# EAGLE design FTDI_AIO (EAGLE 6.4)
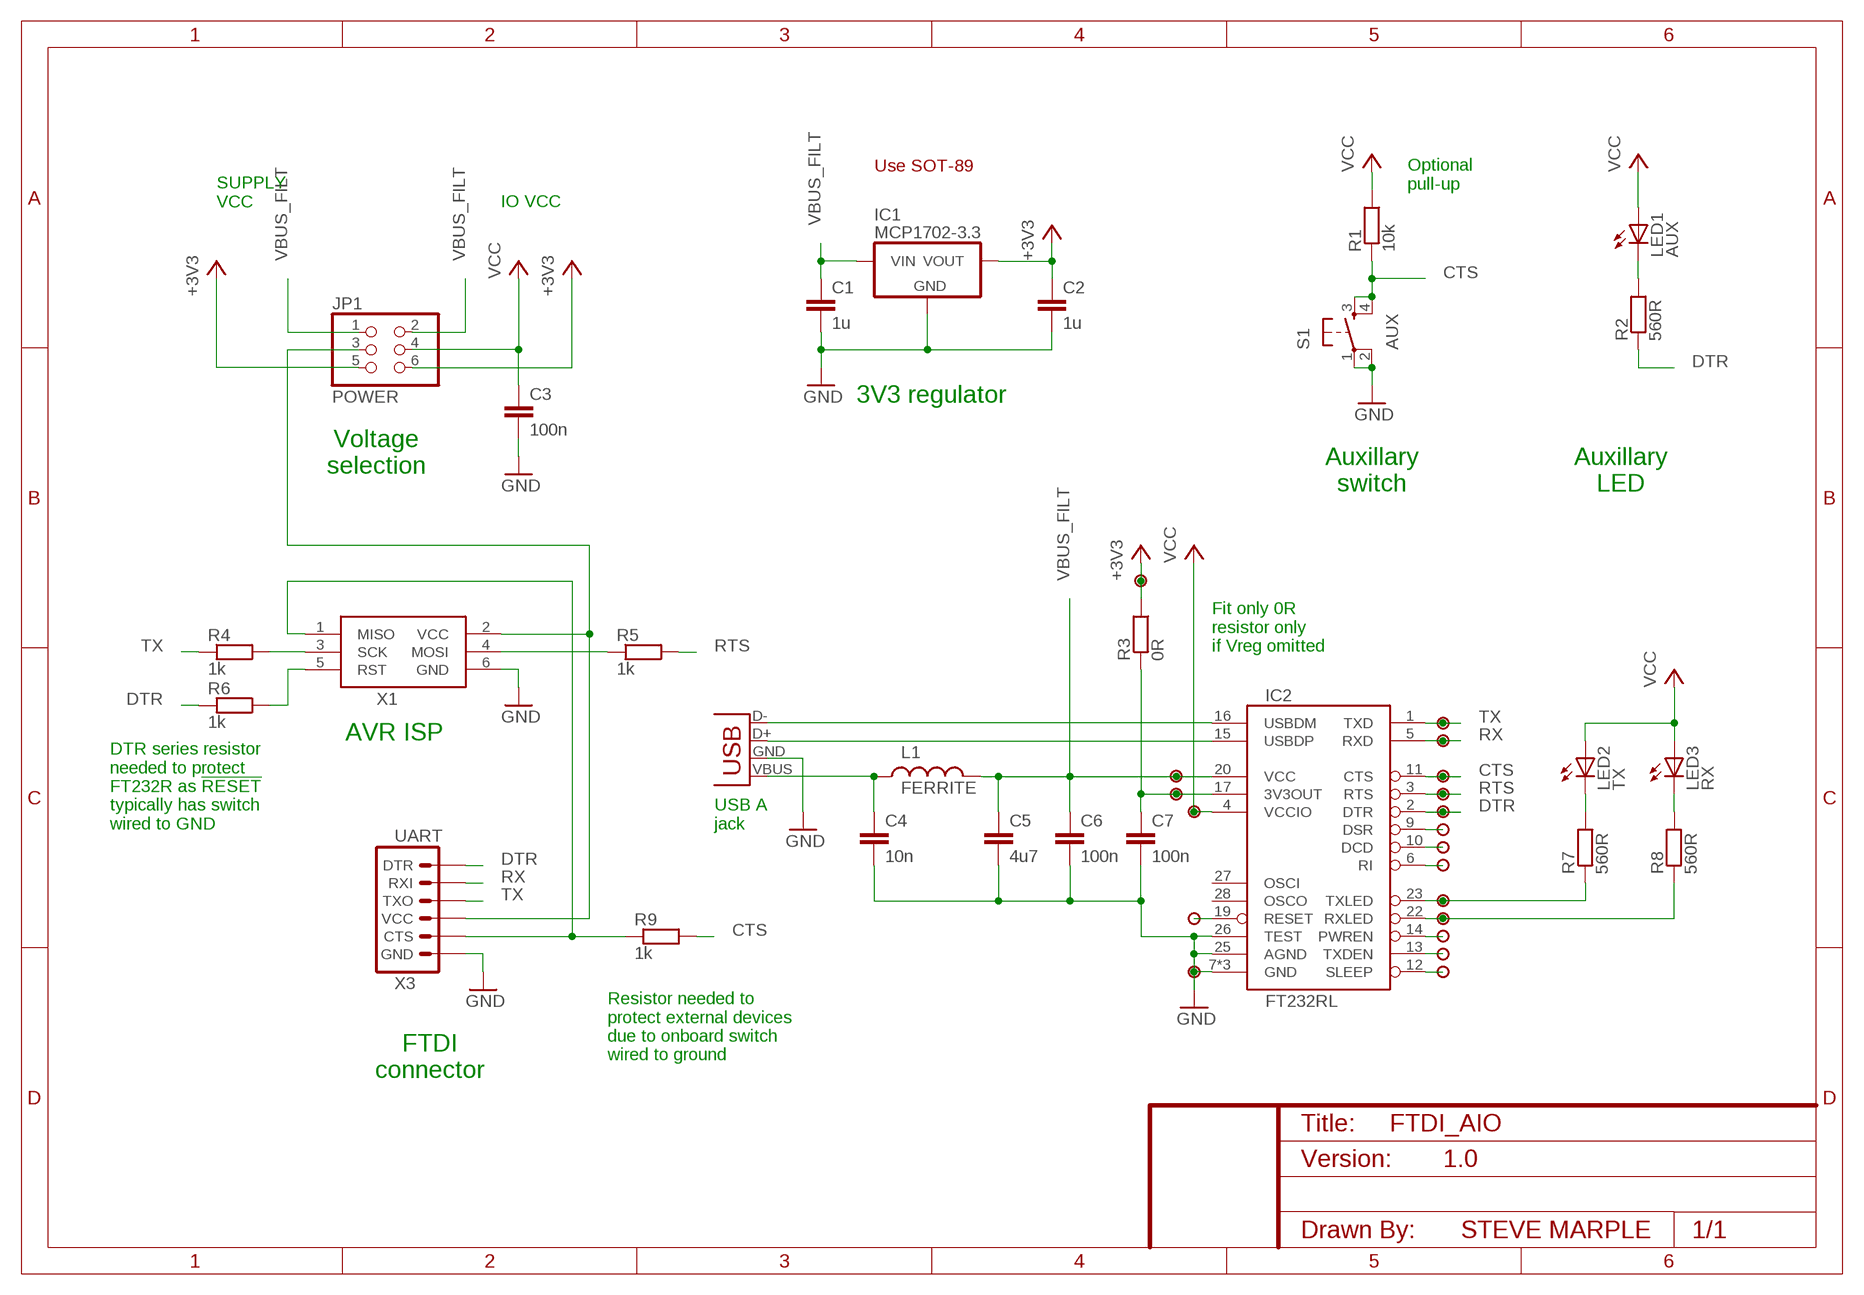
[diagram p0: schematic, sheet 1]

## Parts
C1  1u  C-EU1206-HAND  [1206-HAND]
C2  1u  C-EU1206-HAND  [1206-HAND]
C3  100n  C-EU1206-HAND  [1206-HAND]
C4  10n  C-EU1206-HAND  [1206-HAND]
C5  4u7  C-EU1206-HAND  [1206-HAND]
C6  100n  C-EU1206-HAND  [1206-HAND]
C7  100n  C-EU1206-HAND  [1206-HAND]
IC1  MCP1702-3.3  MCP1702  [TO-92]
IC2  FT232RL  FT232RLSSOP-HAND  [SSOP28-HAND]
JP1  POWER  PINHD-2X3  [2X03]
L1  FERRITE  INDUCTOR0805-HAND  [0805-HAND]
LED1  AUX  LED3MM  [LED3MM]
LED2  TX  LED3MM  [LED3MM]
LED3  RX  LED3MM  [LED3MM]
R1  10k  RESISTOR1206-HAND  [1206-HAND]
R2  560R  RESISTOR1206-HAND  [1206-HAND]
R3  0R  RESISTOR1206-HAND  [1206-HAND]
R4  1k  RESISTOR1206-HAND  [1206-HAND]
R5  1k  RESISTOR1206-HAND  [1206-HAND]
R6  1k  RESISTOR1206-HAND  [1206-HAND]
R7  560R  RESISTOR1206-HAND  [1206-HAND]
R8  560R  RESISTOR1206-HAND  [1206-HAND]
R9  1k  RESISTOR1206-HAND  [1206-HAND]
S1  AUX  TAC_SWITCHPTH  [TACTILE-PTH]
U$1  PAD  [PAD]
U$2  PAD  [PAD]
U$3  PAD  [PAD]
U$4  PAD  [PAD]
U$5  PAD  [PAD]
U$6  PAD  [PAD]
U$7  PAD  [PAD]
U$8  PAD  [PAD]
U$9  PAD  [PAD]
U$10  PAD  [PAD]
U$11  PAD  [PAD]
U$12  PAD  [PAD]
U$13  PAD  [PAD]
U$14  PAD  [PAD]
U$15  PAD  [PAD]
U$16  PAD  [PAD]
U$17  PAD  [PAD]
U$18  PAD  [PAD]
U$19  PAD  [PAD]
X1  ISP  AVRISP-HEADER-6-SHROUDED  [CONN-HARTING-ML6]
X2  USB-A-H  [USB-A-H]
X3  UART  ARDUINO_SERIAL_PROGRAMPTH  [1X06]

## Nets
3V3_OUT: C7.1 IC2.17(3V3OUT) R3.1 U$6.1
!RESET: IC2.19(RESET) U$14.1
+3V3: C2.1 IC1.3(VOUT) JP1.5 JP1.6 R3.2 U$1.1
CTS: IC2.11(CTS) R1.1 R9.2 S1.3 S1.4 U$5.1
CTS_PROT: R9.1 X1.1(MISO) X3.5(CTS)
DTR: IC2.2(DTR) R2.1 R6.1 U$9.1 X3.1(DTR)
EXT_VCC: JP1.3 X1.2(VCC) X3.4(VCC)
GND [power]: C1.2 C2.2 C3.2 C4.2 C5.2 C6.2 C7.2 IC1.1(GND) IC2.7(GND) IC2.18(GND) IC2.21(GND) IC2.25(AGND) IC2.26(TEST) S1.1 S1.2 U$18.1 X1.6(GND) X2.GND(VBUS) X3.6(GND)
N$1: LED1.K(C) R2.2
N$2: R5.1 X1.4(MOSI)
N$7: LED2.K(C) R7.2
N$9: LED3.K(C) R8.2
N$14: IC2.9(DSR) U$10.1
N$21: IC2.10(DCD) U$11.1
N$22: IC2.6(RI) U$12.1
N$23: IC2.14(PWREN) U$16.1
N$24: IC2.13(TXDEN) U$17.1
N$25: IC2.12(SLEEP) U$19.1
RST: R6.2 X1.5(RST)
RTS: IC2.3(RTS) R5.2 U$7.1
RX: IC2.5(RXD) U$3.1 X3.2(RXI)
RXLED: IC2.22(RXLED) R8.1 U$15.1
SCK: R4.2 X1.3(SCK)
TX: IC2.1(TXD) R4.1 U$2.1 X3.3(TXO)
TXLED: IC2.23(TXLED) R7.1 U$13.1
USB_D+: IC2.15(USBDP) X2.D+(D-)
USB_D-: IC2.16(USBDM) X2.D-(D+)
VBUS_FILT [Vbus]: C1.1 C5.1 C6.1 IC1.2(VIN) IC2.20(VCC) JP1.1 JP1.2 L1.2 U$4.1
VCC [power]: C3.1 IC2.4(VCCIO) JP1.4 LED1.A LED2.A LED3.A R1.2 U$8.1
VUSB [Vbus]: C4.1 L1.1 X2.VBUS(GND)
Unconnected: IC2.27(OSCI) IC2.28(OSCO)

## Notes on the sheet
- Use SOT-89
- Optional
  pull-up
- SUPPLY
  VCC
- IO VCC
- 3V3 regulator
- Voltage
  selection
- Auxillary
  switch
- Auxillary
  LED
- Fit only 0R
  resistor only
  if Vreg omitted
- AVR ISP
- DTR series resistor
  needed to protect
  FT232R as !RESET!
  typically has switch
  wired to GND
- USB A
  jack
- Resistor needed to
  protect external devices
  due to onboard switch
  wired to ground
- FTDI
  connector
- 1.0
- STEVE MARPLE

## Library data of the parts
C1-C7 = SteveMarple:C-EU
IC1 = SteveMarple:MCP1702: Microchip MCP1702 250mA low quiescent current (2uA) LDO voltage regulator.
IC2 = SteveMarple:FT232RL: USB UART FT232RL 4th Generation USB UART (USB <-> Serial) Controller. Spark Fun Electronics SKU : COM-00650 Derived from Sparkfun library.
JP1 = pinhead:PINHD-2X3: PIN HEADER
L1 = SteveMarple:INDUCTOR: Inductors Basic Inductor/Choke - 0603 and 1206. Footprints are not proven and vary greatly between part numbers.
LED1-LED3 = SparkFun:LED: LEDs Standard schematic elements and footprints for 5mm, 3mm, 1206, and 0603 sized LEDs. 5mm - Spark Fun Electronics SKU : COM-00529 (and others)
R1-R9 = SteveMarple:RESISTOR: 1/4W PTH resistor
S1 = SparkFun:TAC_SWITCH: Momentary Switch Button commonly used for reset or general input. Spark Fun Electronics SKU : COM-00097
U$1-U$19 = SteveMarple:PAD
X1 = SteveMarple:AVRISP: AVR ISP HEADER Standard 6 pin header for AVR programming
X2 = SteveMarple:USB: USB Connectors USB-B-PTH is fully proven SKU : PRT-00139 USB-miniB is fully proven SKU : PRT-00587 USB-A-PCB is untested. USB-A-H is throughly reviewed, but untested. Spark Fun Electronics SKU : PRT-00437 USB-B-SMT is throughly reviewed, but untested. Needs silkscreen touching up. USB-A-S has not been used/tested USB-MB-H has not been used/tested
X3 = SparkFun:ARDUINO_SERIAL_PROGRAM

## Net classes
2 Vbus: width 0.305 mm

## Board
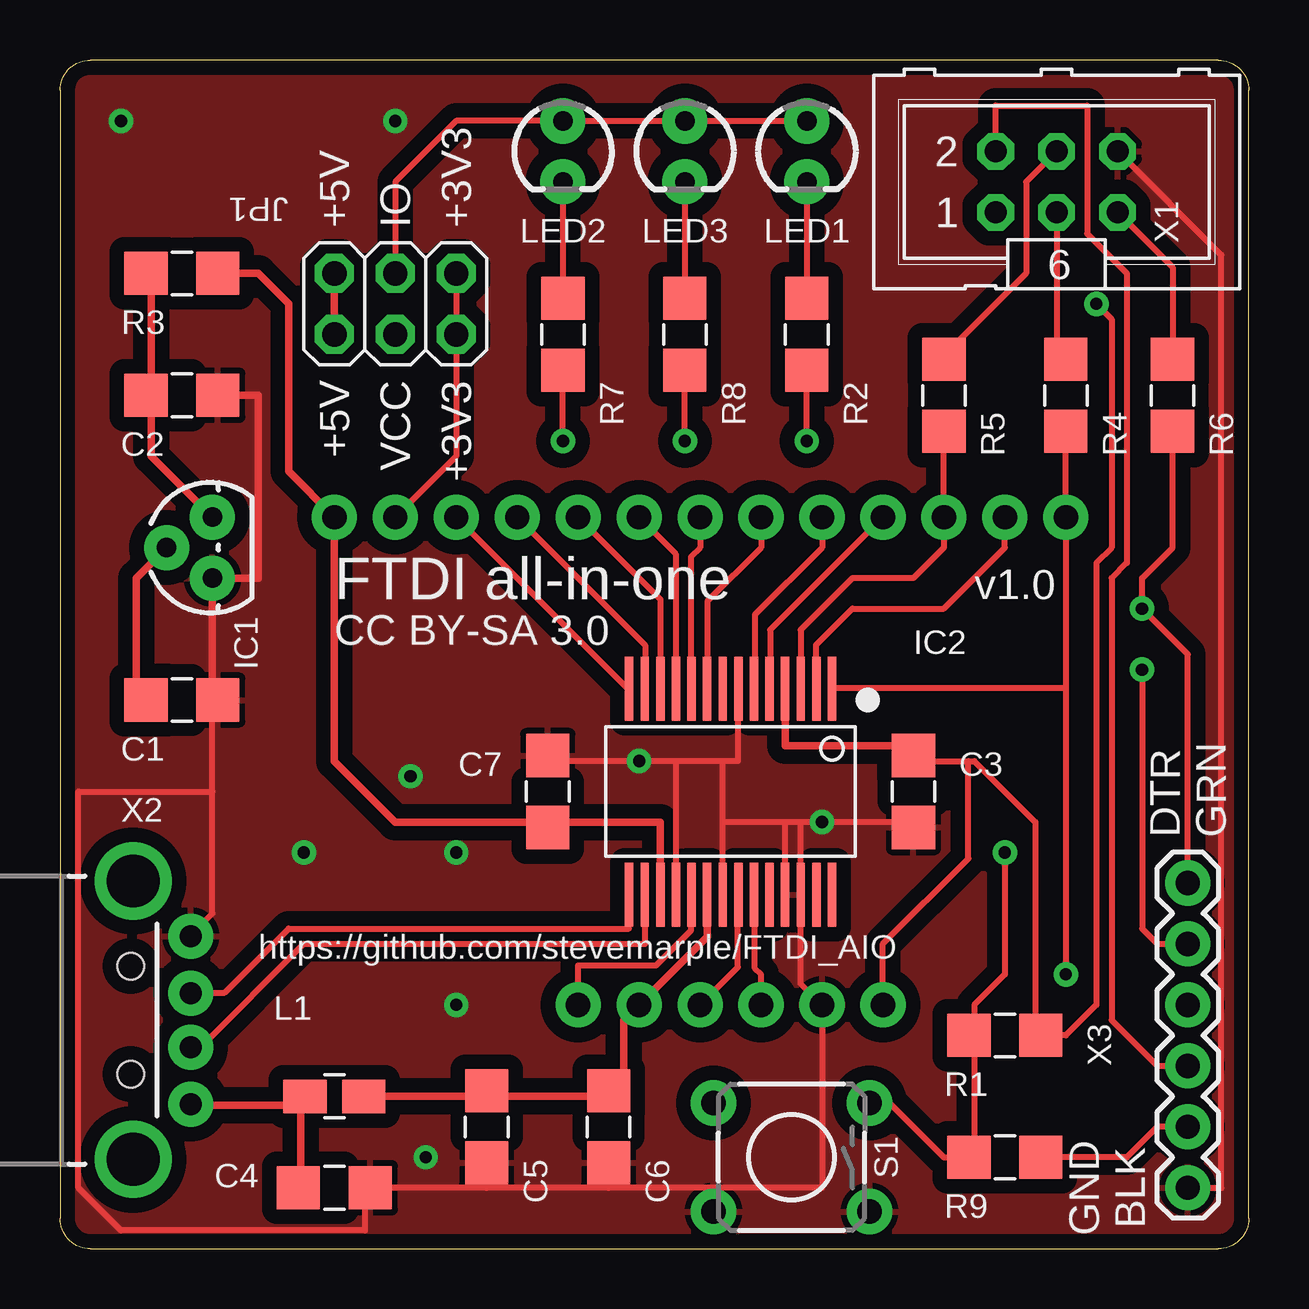
[diagram p1: board, top side]
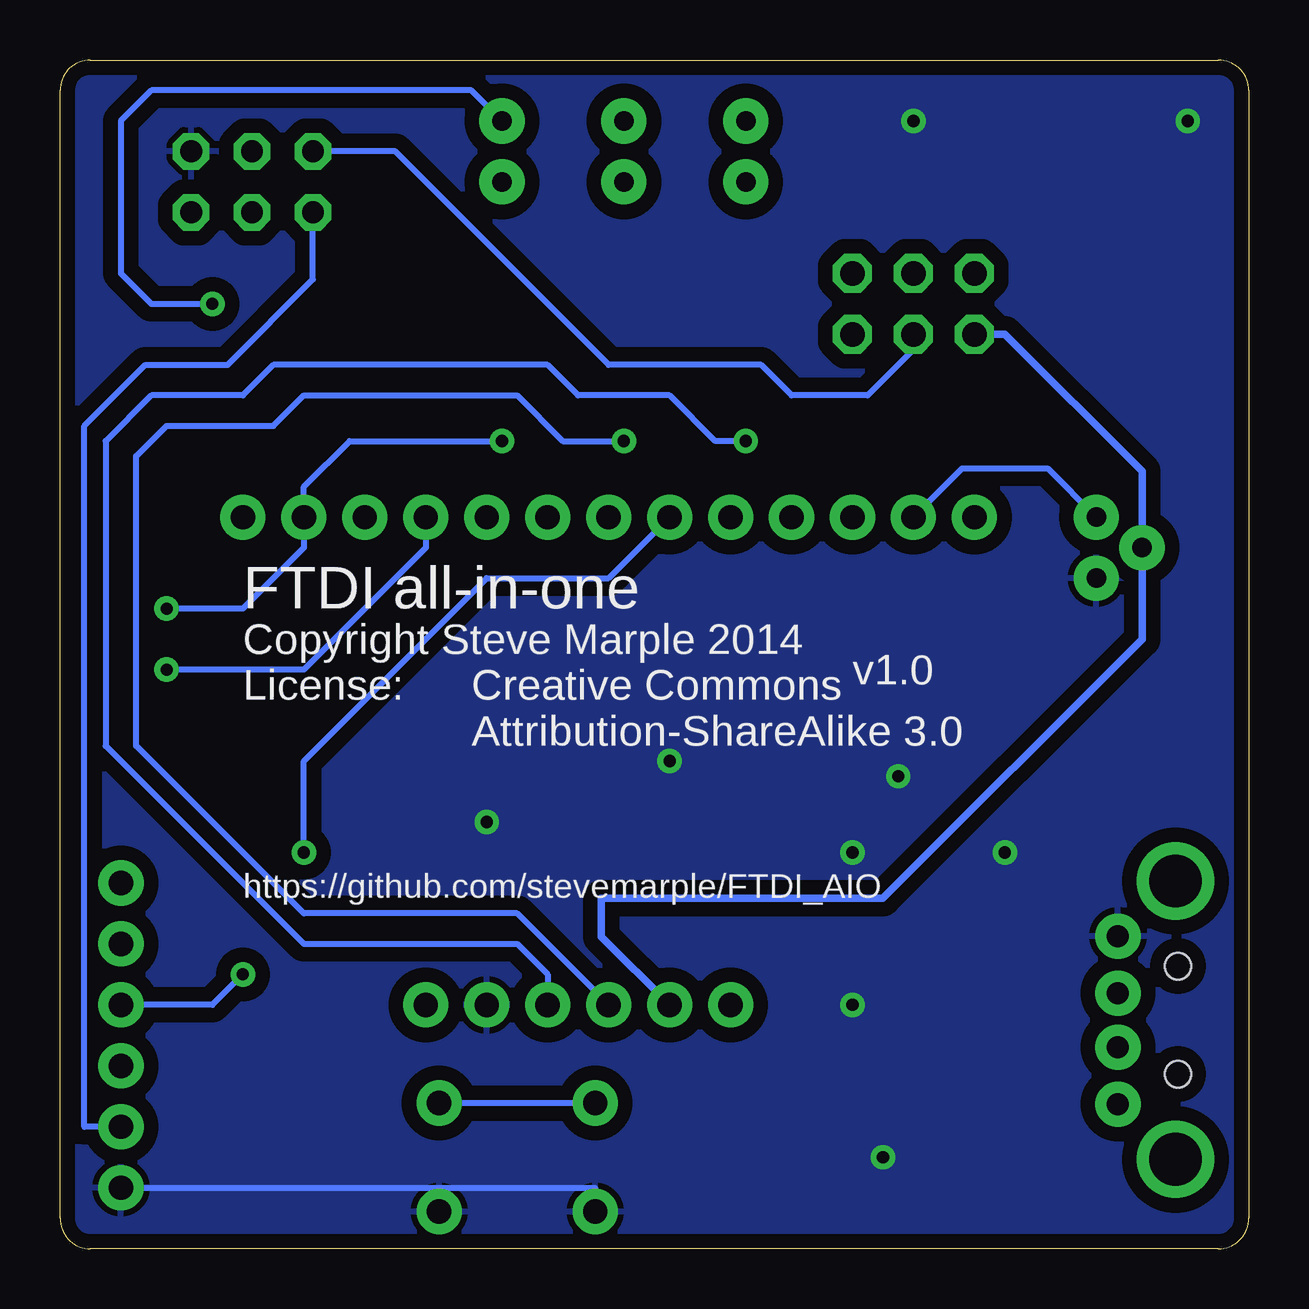
[diagram p2: board, bottom side, seen from below]

Size 49.53 x 49.53 mm. Coordinates in mm from the lower left corner, seen from the top.
Outline: 1.27,0 48.26,0 arc90 49.53,1.27 49.53,48.26 arc90 48.26,49.53 1.27,49.53 arc90 0,48.26 0,1.27 arc90 1.27,0
Copper layers (1*16): Top 0.035mm / dielectric 1.5mm / Bottom 0.035mm
Design rules "SparkFun_Iteadstudio_10mil": minimum track width 10mil, minimum drill 20mil, track to track 10mil, track to pad 10mil, pad to pad 10mil, via to via 10mil, smd to smd 10mil, copper to edge 0.5mm, drill to drill 8mil, minimum pad ring 12mil, minimum via ring 10mil, stop-mask expansion 4mil, vias tented up to drill 25mil, thermal gap 10mil

### Footprints (pad centres in the part's own frame; a part is rotated, then mirrored left to right if it is on the bottom)
1206-HAND = smd 1.8 x 1.803: 1 -1.499,0; 2 1.499,0
TO-92 = drill 0.813 pad 1.88: 1 -1.27,0; 2 0,1.905; 3 1.27,0
SSOP28-HAND = smd 0.348 x 2.667: 1 -4.225,-4.291; 2 -3.575,-4.291; 3 -2.925,-4.291; 4 -2.275,-4.291; 5 -1.625,-4.291; 6 -0.975,-4.291; 7 -0.325,-4.291; 8 0.325,-4.291; 9 0.975,-4.291; 10 1.625,-4.291; 11 2.275,-4.291; 12 2.925,-4.291; 13 3.575,-4.291; 14 4.225,-4.291; 15 4.225,4.291; 16 3.575,4.291; 17 2.925,4.291; 18 2.275,4.291; 19 1.625,4.291; 20 0.975,4.291; 21 0.325,4.291; 22 -0.325,4.291; 23 -0.975,4.291; 24 -1.625,4.291; 25 -2.275,4.291; 26 -2.925,4.291; 27 -3.575,4.291; 28 -4.225,4.291
2X03 = drill 1.016 octagon: 1 -2.54,-1.27; 2 -2.54,1.27; 3 0,-1.27; 4 0,1.27; 5 2.54,-1.27; 6 2.54,1.27
0805-HAND = smd 1.8 x 1.4: 1 -1.225,0; 2 1.225,0
LED3MM = drill 0.813 pad 1.88: A -1.27,0; K 1.27,0
TACTILE-PTH = drill 1.016 pad 1.88: 1 -3.251,2.261; 2 3.251,2.261; 3 -3.251,-2.261; 4 3.251,-2.261
PAD = drill 1.016 pad 1.88: 1 0,0
CONN-HARTING-ML6 = drill 0.914 octagon: 1 -2.54,-1.27; 2 -2.54,1.27; 3 0,-1.27; 4 0,1.27; 5 2.54,-1.27; 6 2.54,1.27
USB-A-H = drill 0.914 pad 1.88: D+ 2.4,1.127; D- 2.4,-1.127; GND 2.4,3.5; VBUS 2.4,-3.5 | drill 2.2: GND2 0,-5.8; GND3 0,5.8 | hole 1.1: -0.1,2.25; -0.1,-2.25
1X06 = drill 1.016 pad 1.88: 1 0,0; 2 2.54,0; 3 5.08,0; 4 7.62,0; 5 10.16,0; 6 12.7,0

### Placement (x,y rotation side)
C1  5.08,22.86 0 top
C2  5.08,35.56 0 top
C3  35.56,19.05 270 top
C4  11.43,2.54 0 top
C5  17.78,5.08 270 top
C6  22.86,5.08 270 top
C7  20.32,19.05 90 top
IC1  6.35,29.21 90 top
IC2  27.94,19.05 180 top
JP1  13.97,39.37 0 top
L1  11.43,6.35 0 top
LED1  31.11,45.72 270 top
LED2  20.95,45.72 270 top
LED3  26.04,45.72 270 top
R1  39.37,8.89 0 top
R2  31.11,38.1 90 top
R3  5.08,40.64 180 top
R4  41.91,35.56 90 top
R5  36.83,35.56 270 top
R6  46.35,35.56 90 top
R7  20.95,38.1 90 top
R8  26.04,38.1 90 top
R9  39.37,3.81 180 top
S1  30.48,3.81 180 top
U$1  13.97,30.48 0 top
U$2  41.91,30.48 90 top
U$3  34.29,30.48 90 top
U$4  24.13,10.16 90 top
U$5  24.13,30.48 90 top
U$6  11.43,30.48 90 top
U$7  36.83,30.48 0 top
U$8  34.29,10.16 0 top
U$9  39.37,30.48 90 top
U$10  29.21,30.48 90 top
U$11  26.67,30.48 90 top
U$12  31.75,30.48 90 top
U$13  29.21,10.16 90 top
U$14  21.59,10.16 90 top
U$15  26.67,10.16 90 top
U$16  16.51,30.48 90 top
U$17  19.05,30.48 90 top
U$18  31.75,10.16 90 top
U$19  21.59,30.48 90 top
X1  41.53,44.45 0 top
X2  3.05,9.53 0 top
X3  46.99,15.24 270 top

### Tracks (layer width: path | path; a pad name or v marks a point on that pad's centre or on a via)
3V3_OUT
  Top 0.254: 25.02,14.86 IC2.17 | 20.32,17.78 C7.1
  Top 0.305: 25.02,14.86 25.02,17.78 20.32,17.78 13.97,17.78 11.43,20.32 U$6.1 9.53,32.38 9.53,39.37 8.26,40.64 R3.1
!RESET
  Top 0.254: U$14.1 21.59,11.81 24.84,11.81 26.29,13.26 26.29,14.73 26.32,14.73 IC2.19
+3V3
  Top 0.254: 3.81,40.64 R3.2 | JP1.6 JP1.5 16.51,33.02 U$1.1 | 3.81,35.43 3.81,35.56 C2.1 3.81,35.43
  Top 0.305: 3.81,40.64 3.81,35.56 | 3.81,35.43 3.81,33.02 IC1.3
  Bottom 0.254: IC1.3 8.38,32.51 11.94,32.51 U$1.1
CTS  (via drill 0.51)
  Top 0.254: U$5.1 25.65,28.96 25.65,23.37 IC2.11 | 38.1,8.89 38.1,3.81 R9.2 36.83,3.81 34.57,6.07 S1.3 | v39.37,16.51 39.37,11.43 38.1,10.16 38.1,8.89 | 38.1,8.89 R1.1 37.85,8.89
  Bottom 0.254: v39.37,16.51 39.37,20.32 31.75,27.94 26.67,27.94 U$5.1 | S1.4 S1.3
CTS_PROT
  Top 0.254: R9.1 44.45,3.81 45.72,5.08 X3.5
  Bottom 0.254: X1.1 38.99,40.39 42.55,36.83 45.97,36.83 48.51,34.29 48.51,5.08 X3.5
DTR  (via drill 0.51)
  Top 0.254: X3.1 46.99,24.77 v45.09,26.67 45.09,27.94 46.35,29.21 46.35,33.66 | v31.11,33.66 R2.1 | IC2.2 31.5,23.37 31.5,25.15 33.02,26.67 36.83,26.67 39.37,29.21 U$9.1 | 45.72,33.66 45.97,33.66 | 46.35,33.66 46.99,33.66 46.99,34.04 45.72,34.04 R6.1 45.97,33.66 | 46.35,33.66 45.97,33.66
  Bottom 0.254: v31.11,33.66 37.47,33.66 39.37,31.75 U$9.1 39.37,29.21 41.91,26.67 v45.09,26.67
EXT_VCC
  Top 0.254: X3.4 45.72,7.62 43.81,9.53 43.81,27.94 44.45,28.57 44.45,40.64 42.8,42.29 42.8,47.62 38.99,47.62 X1.2
  Bottom 0.254: X1.2 35.56,45.72 26.67,36.83 20.32,36.83 19.05,35.56 15.88,35.56 13.97,37.47 JP1.3
GND  (via drill 0.51)
  Top 0.254: X1.6 48.39,41.4 48.39,2.54 X3.6 | 6.48,35.56 C2.2 | 27.6,20.32 28.25,20.32 28.25,22.86 | 27.6,20.32 25.65,20.32 | 25.65,20.32 20.32,20.32 C7.2 | 28.25,23.24 28.25,22.86 | 25.65,20.32 25.65,14.86 IC2.18 | 27.6,20.32 27.6,17.78 | 27.6,17.78 27.6,14.86 IC2.21 | 30.23,17.78 27.6,17.78 | 30.23,17.78 30.23,14.86 IC2.25 | 6.35,19.05 0.76,19.05 0.76,2.54 2.54,0.76 12.7,0.76 12.7,2.54 C4.2 17.78,2.54 | 27.23,2.54 22.86,2.54 | 22.86,2.54 17.78,2.54 | 6.35,22.99 6.48,22.86 C1.2 6.35,22.86 6.35,19.05 | 6.35,19.05 6.35,13.97 5.46,13.08 X2.GND | 27.23,2.54 S1.2 | 27.23,2.54 31.75,2.54 U$18.1 30.86,11.05 IC2.26 30.86,14.73 30.86,17.78 | 30.86,17.78 30.23,17.78 | IC2.7 28.25,22.86 | C5.2 17.78,2.54 | C6.2 22.86,2.54 | C3.2 35.56,17.78 30.86,17.78
  Top 0.305: 6.35,22.99 IC1.1 8.26,27.94 8.26,35.56 C2.2
  Bottom 0.254: X3.6 33.73,2.54 | 33.73,2.54 27.23,2.54 S1.2 | S1.1 33.73,2.54
  other vias: 2.54,46.99 13.97,46.99 14.61,19.68 16.51,16.51 24.13,20.32 16.51,10.16 10.16,16.51 15.24,3.81 31.75,17.78
  pour Top (isolate 0.61): -1.27,50.8 50.8,50.8 50.8,-1.27 -1.27,-1.27
  pour Bottom (isolate 0.61): -2.54,52.07 52.07,52.07 52.07,-2.54 -2.54,-2.54
N$1
  Top 0.254: LED1.K R2.2
N$2
  Top 0.254: X1.4 40.26,44.45 40.26,40.64 36.83,37.21 R5.1
N$7
  Top 0.254: LED2.K R7.2
N$9
  Top 0.254: LED3.K R8.2
N$14
  Top 0.254: U$10.1 29.21,29.21 26.98,26.98 26.98,23.37 IC2.9
N$21
  Top 0.254: U$11.1 26.67,29.21 26.29,28.83 26.29,23.37 IC2.10
N$22
  Top 0.254: U$12.1 31.75,29.21 28.96,26.42 28.96,23.37 IC2.6
N$23
  Top 0.254: U$16.1 23.62,23.37 IC2.14
N$24
  Top 0.254: U$17.1 24.38,25.15 24.38,23.37 IC2.13
N$25
  Top 0.254: U$19.1 25.02,27.05 25.02,23.37 IC2.12
RST
  Top 0.254: R6.2 46.35,40.89 X1.5
RTS
  Top 0.254: R5.2 U$7.1 36.83,29.21 35.56,27.94 33.02,27.94 30.86,25.78 30.86,23.73 IC2.3
RX  (via drill 0.51)
  Top 0.254: U$3.1 29.59,25.78 29.59,23.37 IC2.5 | X3.2 45.72,12.7 45.09,13.34 v45.09,24.13
  Bottom 0.254: U$3.1 34.29,29.21 39.37,24.13 v45.09,24.13
RXLED  (via drill 0.51)
  Top 0.254: v26.04,33.66 R8.1 | U$15.1 28.25,11.73 28.25,14.73 IC2.22
  Bottom 0.254: v26.04,33.66 28.57,33.66 30.48,35.56 39.37,35.56 40.64,34.29 45.09,34.29 46.35,33.02 46.35,20.95 39.37,13.97 30.48,13.97 U$15.1
SCK
  Top 0.254: X1.3 41.53,37.47 41.91,37.47 R4.2
TX  (via drill 0.51)
  Top 0.254: R4.1 U$2.1 41.91,23.37 | IC2.1 32.26,23.37 41.91,23.37 | 41.91,23.37 v41.91,11.43
  Bottom 0.254: v41.91,11.43 43.18,10.16 X3.3
TXLED  (via drill 0.51)
  Top 0.254: 20.95,36.83 R7.1 v20.95,33.66 | U$13.1 29.21,11.43 28.96,11.68 28.96,14.73 IC2.23
  Bottom 0.254: v20.95,33.66 22.23,33.66 24.13,35.56 27.94,35.56 29.21,36.83 40.64,36.83 41.91,35.56 45.72,35.56 47.62,33.66 47.62,20.95 39.37,12.7 30.48,12.7 29.21,11.43 U$13.1
USB_D+
  Top 0.254: IC2.15 23.7,14.61 23.7,13.34 9.53,13.34 6.86,10.67 5.46,10.67 X2.D+
USB_D-
  Top 0.254: IC2.16 24.38,14.73 24.38,12.7 10.16,12.7 5.84,8.38 5.46,8.38 X2.D-
VBUS_FILT
  Top 0.305: IC2.20 26.98,14.73 26.98,13.01 U$4.1 23.5,9.53 23.5,6.6 22.86,6.6 C6.1 22.86,6.35 17.78,6.35 | 13.34,6.35 L1.2 12.65,6.48 13.34,6.35 | 13.34,6.35 17.78,6.35 | 3.68,22.86 C1.1 3.17,22.86 3.17,27.94 IC1.2 | JP1.2 JP1.1 | C5.1 17.78,6.35
  Bottom 0.305: JP1.1 10.16,38.1 4.45,32.38 IC1.2 4.45,25.4 15.24,14.61 26.98,14.61 26.98,13.01 U$4.1
VCC  (via drill 0.51)
  Top 0.254: 37.85,20.32 38.1,20.32 40.64,17.78 40.64,8.89 | 37.85,20.32 35.56,20.32 C3.1 35.56,20.95 | 30.23,23.24 IC2.4 | JP1.4 13.97,44.45 16.51,46.99 LED2.A LED3.A LED1.A | v43.18,39.37 43.81,38.73 43.81,29.21 43.18,28.57 43.18,10.16 41.91,8.89 R1.2 40.64,8.89 | U$8.1 34.29,12.7 37.85,16.26 37.85,20.32 | 40.64,8.89 40.64,8.26
  Top 0.305: 30.23,23.24 30.23,20.95 35.56,20.95
  Bottom 0.254: v43.18,39.37 45.72,39.37 46.99,40.64 46.99,46.99 45.72,48.26 32.38,48.26 LED1.A
VUSB
  Top 0.305: 10.03,5.97 10.03,2.54 C4.1 | 10.03,5.97 10.03,6.22 10.16,6.35 L1.1 10.03,5.97 | 10.03,5.97 5.46,5.97 X2.VBUS

### Text on the board
_tsilk: +5V | IO | +3V3 | +5V | VCC | +3V3 | FTDI all-in-one | v1.0 | CC BY-SA 3.0 | DTR / GRN | https://github.com/stevemarple/FTDI_AIO | GND / BLK
_bsilk: FTDI all-in-one | Copyright Steve Marple 2014 | Creative Commons / Attribution-ShareAlike 3.0 | License: | v1.0 | https://github.com/stevemarple/FTDI_AIO